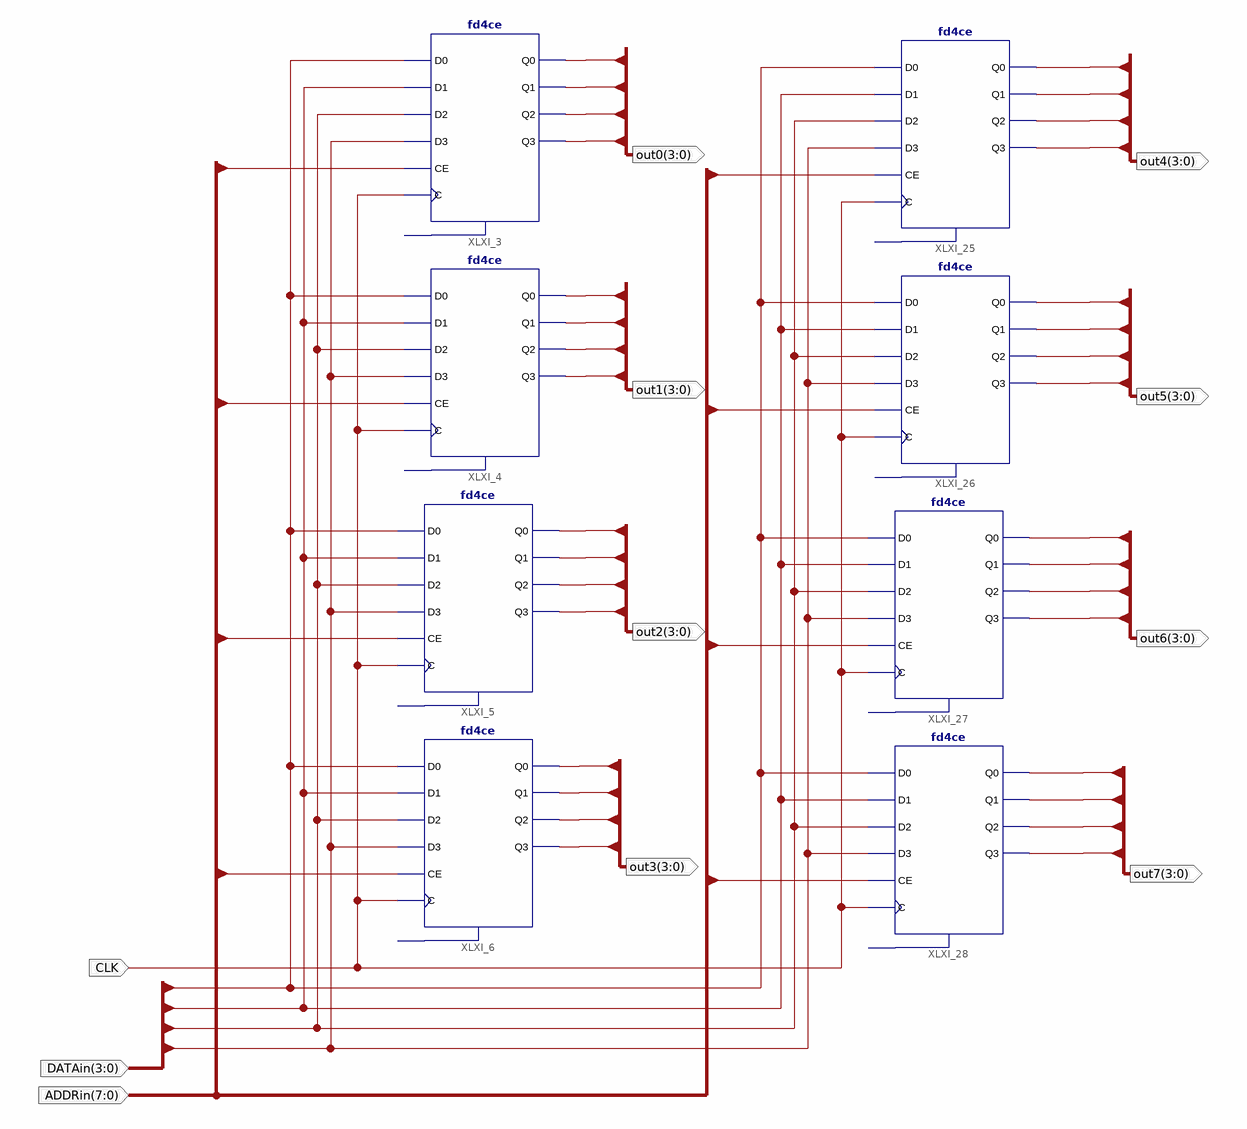
[diagram p0: schematic sheet 1]
// Xilinx ISE schematic Memory.sch (spartan3e) as structural Verilog: 8 symbols, 11 ports
module Memory (
  input  [7:0] ADDRin,
  input  [3:0] DATAin,
  input  CLK,
  output [3:0] out3,
  output [3:0] out2,
  output [3:0] out1,
  output [3:0] out0,
  output [3:0] out7,
  output [3:0] out6,
  output [3:0] out5,
  output [3:0] out4
);

  fd4ce XLXI_6 (
    .C(CLK), .CE(ADDRin[3]), .D0(DATAin[0]), .D1(DATAin[1]), .D2(DATAin[2]), .D3(DATAin[3]), .Q0(out3[0]),
    .Q1(out3[1]), .Q2(out3[2]), .Q3(out3[3]));  // open: CLR
  fd4ce XLXI_5 (
    .C(CLK), .CE(ADDRin[2]), .D0(DATAin[0]), .D1(DATAin[1]), .D2(DATAin[2]), .D3(DATAin[3]), .Q0(out2[0]),
    .Q1(out2[1]), .Q2(out2[2]), .Q3(out2[3]));  // open: CLR
  fd4ce XLXI_4 (
    .C(CLK), .CE(ADDRin[1]), .D0(DATAin[0]), .D1(DATAin[1]), .D2(DATAin[2]), .D3(DATAin[3]), .Q0(out1[0]),
    .Q1(out1[1]), .Q2(out1[2]), .Q3(out1[3]));  // open: CLR
  fd4ce XLXI_3 (
    .C(CLK), .CE(ADDRin[0]), .D0(DATAin[0]), .D1(DATAin[1]), .D2(DATAin[2]), .D3(DATAin[3]), .Q0(out0[0]),
    .Q1(out0[1]), .Q2(out0[2]), .Q3(out0[3]));  // open: CLR
  fd4ce XLXI_25 (
    .C(CLK), .CE(ADDRin[4]), .D0(DATAin[0]), .D1(DATAin[1]), .D2(DATAin[2]), .D3(DATAin[3]), .Q0(out4[0]),
    .Q1(out4[1]), .Q2(out4[2]), .Q3(out4[3]));  // open: CLR
  fd4ce XLXI_26 (
    .C(CLK), .CE(ADDRin[5]), .D0(DATAin[0]), .D1(DATAin[1]), .D2(DATAin[2]), .D3(DATAin[3]), .Q0(out5[0]),
    .Q1(out5[1]), .Q2(out5[2]), .Q3(out5[3]));  // open: CLR
  fd4ce XLXI_27 (
    .C(CLK), .CE(ADDRin[6]), .D0(DATAin[0]), .D1(DATAin[1]), .D2(DATAin[2]), .D3(DATAin[3]), .Q0(out6[0]),
    .Q1(out6[1]), .Q2(out6[2]), .Q3(out6[3]));  // open: CLR
  fd4ce XLXI_28 (
    .C(CLK), .CE(ADDRin[7]), .D0(DATAin[0]), .D1(DATAin[1]), .D2(DATAin[2]), .D3(DATAin[3]), .Q0(out7[0]),
    .Q1(out7[1]), .Q2(out7[2]), .Q3(out7[3]));  // open: CLR
endmodule
